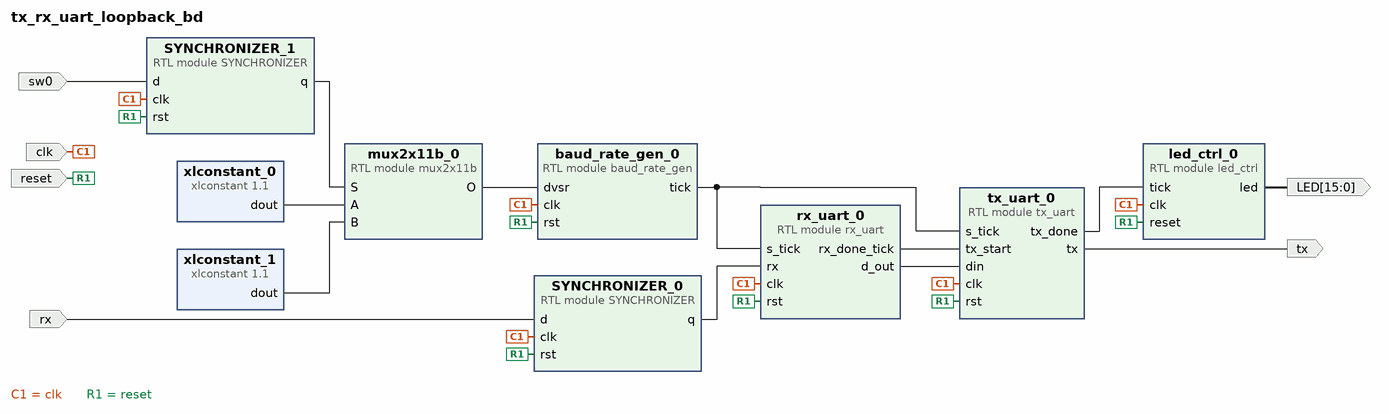
[diagram p0: block diagram of the top level]
# Vivado block design tx_rx_uart_loopback_bd, xc7a100tcsg324-1, Vivado 2018.2.1
create_bd_design tx_rx_uart_loopback_bd

create_bd_port -dir I sw0
create_bd_port -dir I -type clk clk
set_property -dict {CONFIG.ASSOCIATED_RESET reset} [get_bd_ports clk]
create_bd_port -dir I -type rst reset
create_bd_port -dir I rx
create_bd_port -dir O tx
create_bd_port -dir O -from 15 -to 0 LED

create_bd_cell -type module -reference mux2x11b mux2x11b_0
create_bd_cell -type module -reference led_ctrl led_ctrl_0
create_bd_cell -type ip -vlnv xilinx.com:ip:xlconstant:1.1 xlconstant_0
set_property -dict {CONFIG.CONST_WIDTH 11 CONFIG.CONST_VAL 650} [get_bd_cells xlconstant_0]
create_bd_cell -type ip -vlnv xilinx.com:ip:xlconstant:1.1 xlconstant_1
set_property -dict {CONFIG.CONST_WIDTH 11 CONFIG.CONST_VAL 54} [get_bd_cells xlconstant_1]
create_bd_cell -type module -reference tx_uart tx_uart_0
create_bd_cell -type module -reference rx_uart rx_uart_0
create_bd_cell -type module -reference baud_rate_gen baud_rate_gen_0
create_bd_cell -type module -reference SYNCHRONIZER SYNCHRONIZER_0
create_bd_cell -type module -reference SYNCHRONIZER SYNCHRONIZER_1

# ---- connections ----

connect_bd_net [get_bd_pins xlconstant_0/dout] [get_bd_pins mux2x11b_0/A]
connect_bd_net [get_bd_pins xlconstant_1/dout] [get_bd_pins mux2x11b_0/B]
connect_bd_net -net clk_0_1 [get_bd_ports clk] \
  [get_bd_pins led_ctrl_0/clk] [get_bd_pins tx_uart_0/clk] [get_bd_pins rx_uart_0/clk] [get_bd_pins baud_rate_gen_0/clk] \
  [get_bd_pins SYNCHRONIZER_0/clk] [get_bd_pins SYNCHRONIZER_1/clk]
connect_bd_net -net rst_0_1 [get_bd_ports reset] \
  [get_bd_pins led_ctrl_0/reset] [get_bd_pins tx_uart_0/rst] [get_bd_pins rx_uart_0/rst] [get_bd_pins baud_rate_gen_0/rst] \
  [get_bd_pins SYNCHRONIZER_0/rst] [get_bd_pins SYNCHRONIZER_1/rst]
connect_bd_net [get_bd_pins baud_rate_gen_0/tick] [get_bd_pins tx_uart_0/s_tick] [get_bd_pins rx_uart_0/s_tick]
connect_bd_net [get_bd_pins rx_uart_0/rx_done_tick] [get_bd_pins tx_uart_0/tx_start]
connect_bd_net [get_bd_pins rx_uart_0/d_out] [get_bd_pins tx_uart_0/din]
connect_bd_net [get_bd_pins tx_uart_0/tx] [get_bd_ports tx]
connect_bd_net [get_bd_pins tx_uart_0/tx_done] [get_bd_pins led_ctrl_0/tick]
connect_bd_net [get_bd_pins led_ctrl_0/led] [get_bd_ports LED]
connect_bd_net [get_bd_ports rx] [get_bd_pins SYNCHRONIZER_0/d]
connect_bd_net [get_bd_pins SYNCHRONIZER_0/q] [get_bd_pins rx_uart_0/rx]
connect_bd_net -net sw0_1 [get_bd_ports sw0] [get_bd_pins SYNCHRONIZER_1/d]
connect_bd_net [get_bd_pins SYNCHRONIZER_1/q] [get_bd_pins mux2x11b_0/S]
connect_bd_net [get_bd_pins mux2x11b_0/O] [get_bd_pins baud_rate_gen_0/dvsr]

validate_bd_design
save_bd_design
